# EAGLE design SparkFun_Pogo_Pi_AVR_Programmer_ADAPTER-SparkFunHeader (EAGLE 7.7.0)
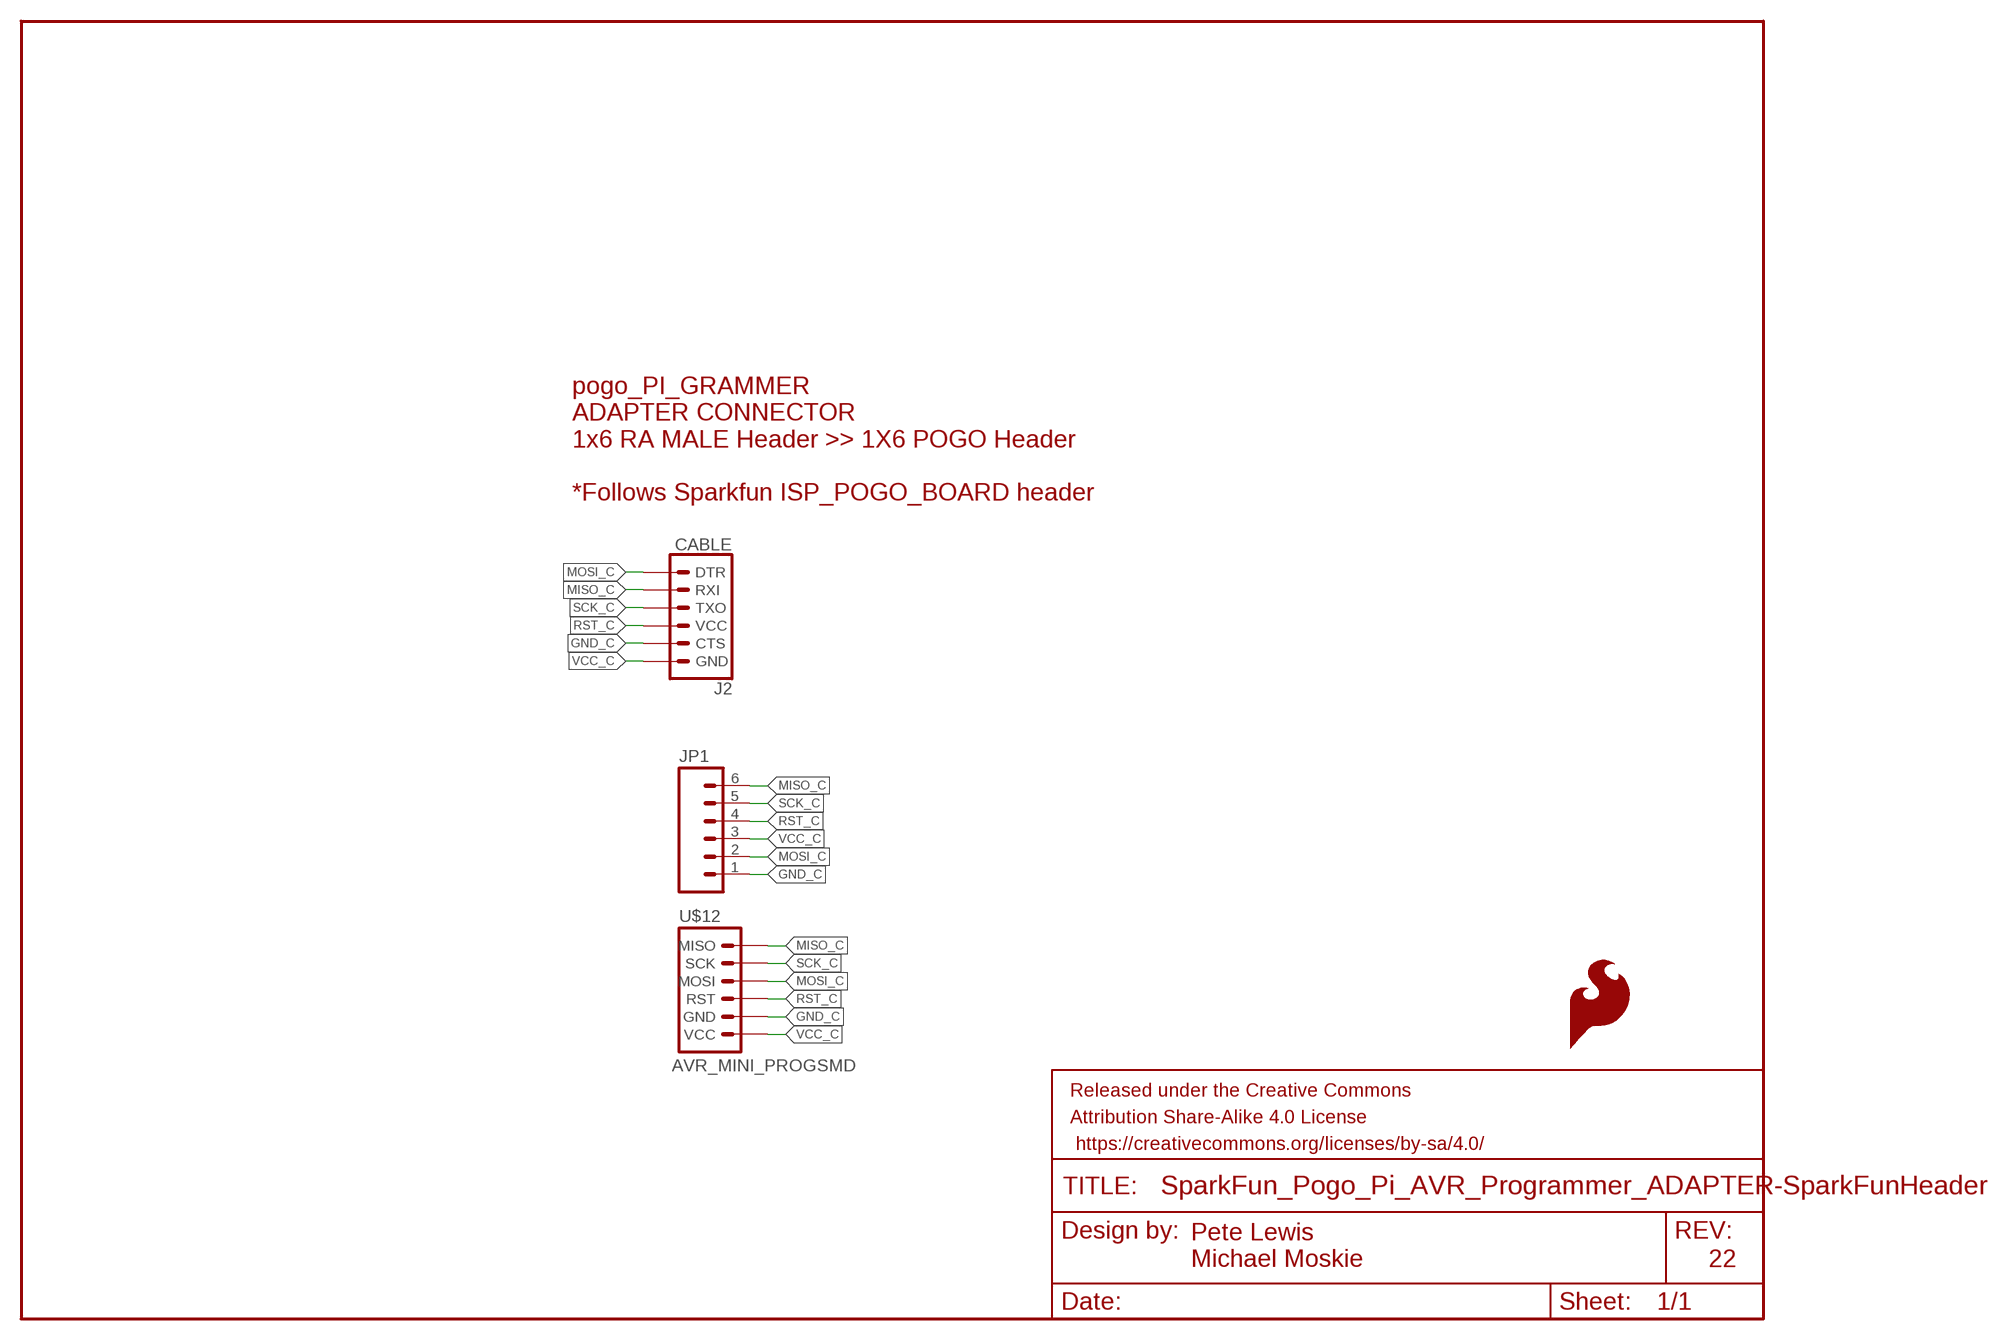
[diagram p0: schematic, sheet 1]

## Parts
FRAME1  FRAME-LETTER  [CREATIVE_COMMONS]
J2  CABLE  6_PIN_SERIAL_TARGETSMD  [1X06-SMD_RA_MALE]
JP1  M06POLAR  [MOLEX-1X6]
LOGO1  SFE_LOGO_FLAME.1_INCH  [SFE_LOGO_FLAME_.1]
U$12  AVR_MINI_PROGSMD  [AVR_MINI_PROG]

## Nets
GND_C: J2.5(CTS) JP1.1 U$12.2(GND)
MISO_C: J2.2(RXI) JP1.6 U$12.6(MISO)
MOSI_C: J2.1(DTR) JP1.2 U$12.4(MOSI)
RST_C: J2.4(VCC) JP1.4 U$12.3(RST)
SCK_C: J2.3(TXO) JP1.5 U$12.5(SCK)
VCC_C: J2.6(GND) JP1.3 U$12.1(VCC)

## Notes on the sheet
- pogo_PI_GRAMMER
  ADAPTER CONNECTOR
  1x6 RA MALE Header >> 1X6 POGO Header
  
  *Follows Sparkfun ISP_POGO_BOARD header
- Pete Lewis
  Michael Moskie
- 22

## Library data of the parts
FRAME1 = SparkFun-Aesthetics:FRAME-LETTER: Schematic Frame - Letter Standard 8.5x11 US Letter frame
J2 = SparkFun-Connectors:6_PIN_SERIAL_TARGET: 6-pin header connection for use with the "FTDI BASIC" pinout - TARGET SIDE. Also known as "Arduino Serial Program Header". It is used to mate with our FTDI Basic serial programmers using the Arduino IDE. Note, this device has "TARGET" in the name. It is intended to be used on a design that contains a target micro-controller that you wish to program. The "sister" device, named "CABLE" is inteneded to be used on a design that usually lives on the end of your USB cable and prvides the converter chip (FTDI232 or FTDI231x) to commnicate serial RX/TX. You can populate with some of these: Break Away Headers - Straight <https://www.sparkfun.com/products/116> (PRT-00116) For reference (or to suit your programming needs) check out these designs: SparkFun FTDI Basic Breakout - 5V <https://www.sparkfun.com/products/9716> (DEV-09716) SparkFun FTDI Basic Breakout - 3.3V <https://www.sparkfun.com/products/9873> (DEV-09873) SparkFun FTDI SmartBasic <https://www.sparkfun.com/products/12935> (DEV-12935) SparkFun Beefy 3 - FTDI Basic Breakout <https://www.sparkfun.com/products/13746> (DEV-13746); PROD_ID: CONN-10140
JP1 = SparkFun-Connectors:M06: Header 6 Standard 6-pin 0.1" header. Use with straight break away headers (SKU : PRT-00116), right angle break away headers (PRT-00553), swiss pins (PRT-00743), machine pins (PRT-00117), and female headers (PRT-00115). Molex polarized connector foot print use with SKU : PRT-08094 with associated crimp pins and housings. NOTES ON THE VARIANTS LOCK and LOCK_LONGPADS... This footprint was designed to help hold the alignment of a through-hole component (i.e. 6-pin header) while soldering it into place. You may notice that each hole has been shifted either up or down by 0.005 of an inch from it's more standard position (which is a perfectly straight line). This slight alteration caused the pins (the squares in the middle) to touch the edges of the holes. Because they are alternating, it causes a "brace" to hold the component in place. 0.005 has proven to be the perfect amount of "off-center" position when using our standard breakaway headers. Although looks a little odd when you look at the bare footprint, once you have a header in there, the alteration is very hard to notice. Also, if you push a header all the way into place, it is covered up entirely on the bottom side. This idea of altering the position of holes to aid alignment will be further integrated into the Sparkfun Library for other footprints. It can help hold any component with 3 or more connection pins.
LOGO1 = SparkFun-Aesthetics:SFE_LOGO_FLAME: SparkFun Flame Logo This is the SparkFun flame logo. The logo on the schematic will always be the same size; the package variant is the height of the flame. Default layer for the logo on the board is tSilk.
U$12 = SparkFun-Connectors:AVR_MINI_PROG: AVR ISP 6-pin inline header

## Board
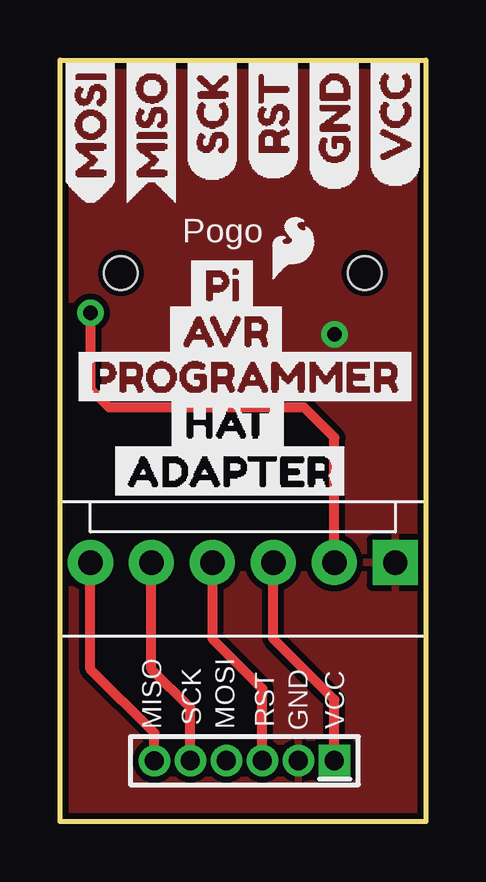
[diagram p1: board, top side]
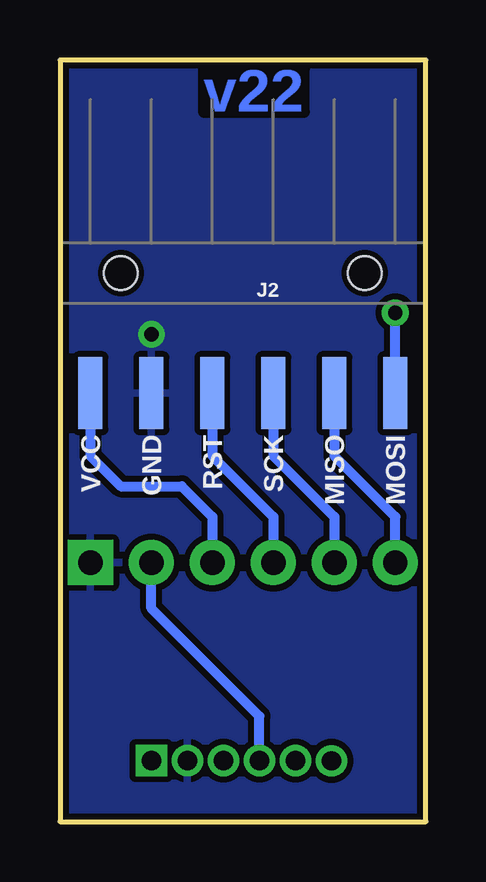
[diagram p2: board, bottom side, seen from below]

Size 15.24 x 31.75 mm. Coordinates in mm from the lower left corner, seen from the top.
Outline: 15.24,0 0,0 0,31.75 15.24,31.75 15.24,0
Copper layers (1*16): Top 0.035mm / dielectric 1.5mm / Bottom 0.035mm
Design rules "SparkFun-2-layer-STANDARD": minimum track width 10mil, minimum drill 20mil, track to track 10mil, track to pad 8mil, pad to pad 8mil, via to via 10mil, smd to smd 8mil, copper to edge 8mil, drill to drill 8mil, minimum pad ring 10mil, minimum via ring 10mil, stop-mask expansion 4mil, vias tented up to drill 25mil, thermal gap 10mil

### Footprints (pad centres in the part's own frame; a part is rotated, then mirrored left to right if it is on the bottom)
1X06-SMD_RA_MALE = smd 1 x 3: 1 -6.35,5; 2 -3.81,5; 3 -1.27,5; 4 1.27,5; 5 3.81,5; 6 6.35,5 | hole 1.4: -5.08,0; 5.08,0
MOLEX-1X6 = drill 1.016 pad 1.88 square: 1 0,0 | drill 1.016 pad 1.88: 2 2.54,0; 3 5.08,0; 4 7.62,0; 5 10.16,0; 6 12.7,0
AVR_MINI_PROG = drill 0.8 pad 1.27 square: 1 0,0 | drill 0.8 pad 1.27: 2 1.5,0; 3 3,0; 4 4.5,0; 5 6,0; 6 7.5,0.01

### Placement (x,y rotation side)
FRAME1  -21.59,-12.7 0 top  (outside the outline)
J2  7.62,22.86 180 bottom
JP1  13.97,10.79 180 top
LOGO1  8.56,22.28 0 top
U$1  [GND1]  11.43,26.29 90 top
U$2  [MISO5]  3.81,25.65 90 top
U$3  [MOSI4]  1.27,25.65 90 top
U$4  [RST2]  8.89,26.67 90 top
U$5  [SCK3]  6.35,26.67 90 top
U$6  [VCC0]  13.97,26.42 90 top
U$7  [PI0]  4.83,22.35 0 top
U$8  [AVR1]  3.94,20.45 0 top
U$9  [PROGRAMMER2]  0.13,18.54 0 top
U$10  [HAT3]  4.06,16.64 0 top
U$11  [ADAPTER4]  1.65,14.61 0 top
U$12  11.43,2.54 180 top

### Tracks (layer width: path | path; a pad name or v marks a point on that pad's centre or on a via)
GND_C  (via drill 0.6)
  other vias: 11.43,20.32
  pour Bottom (isolate 0.254): 15.24,0 0,0 0,31.75 15.24,31.75
  pour Top (isolate 0.254): 15.24,0 0,0 0,31.75 15.24,31.75
MISO_C
  Top 0.406: U$12.6 3.93,3.69 1.27,6.35 JP1.6
  Bottom 0.406: J2.2 3.81,15.24 1.27,12.7 JP1.6
MOSI_C  (via drill 0.6)
  Top 0.406: v1.27,21.21 1.27,18.03 2.03,17.27 10.16,17.27 11.43,16 JP1.2
  Bottom 0.406: U$12.4 6.93,4.39 11.43,8.89 JP1.2 | J2.1 v1.27,21.21
RST_C
  Top 0.406: JP1.4 6.35,7.62 8.43,5.54 U$12.3
  Bottom 0.406: J2.4 8.89,15.24 6.35,12.7 JP1.4
SCK_C
  Top 0.406: U$12.5 5.43,4.73 3.81,6.35 JP1.5
  Bottom 0.406: J2.3 6.35,15.24 3.81,12.7 JP1.5
VCC_C
  Top 0.406: U$12.1 11.43,5.08 8.89,7.62 JP1.3
  Bottom 0.406: J2.6 13.97,15.24 12.7,13.97 10.16,13.97 8.89,12.7 JP1.3

### Text on the board
Bottom: v22
Unrouted: Modified by: Michael Moskie
tPlace: Pogo | MISO | SCK | MOSI | RST | GND | VCC
bPlace: MOSI | MISO | SCK | RST | GND | VCC
tDocu: Pete Lewis